# Altium schematic sheet Sheet1.SchDoc
size A0; Organization: Altium Limited; Address1: L3, 12a Rodborough Rd; Address2: Frenchs Forest; Address3: NSW; Address4: Australia 2086
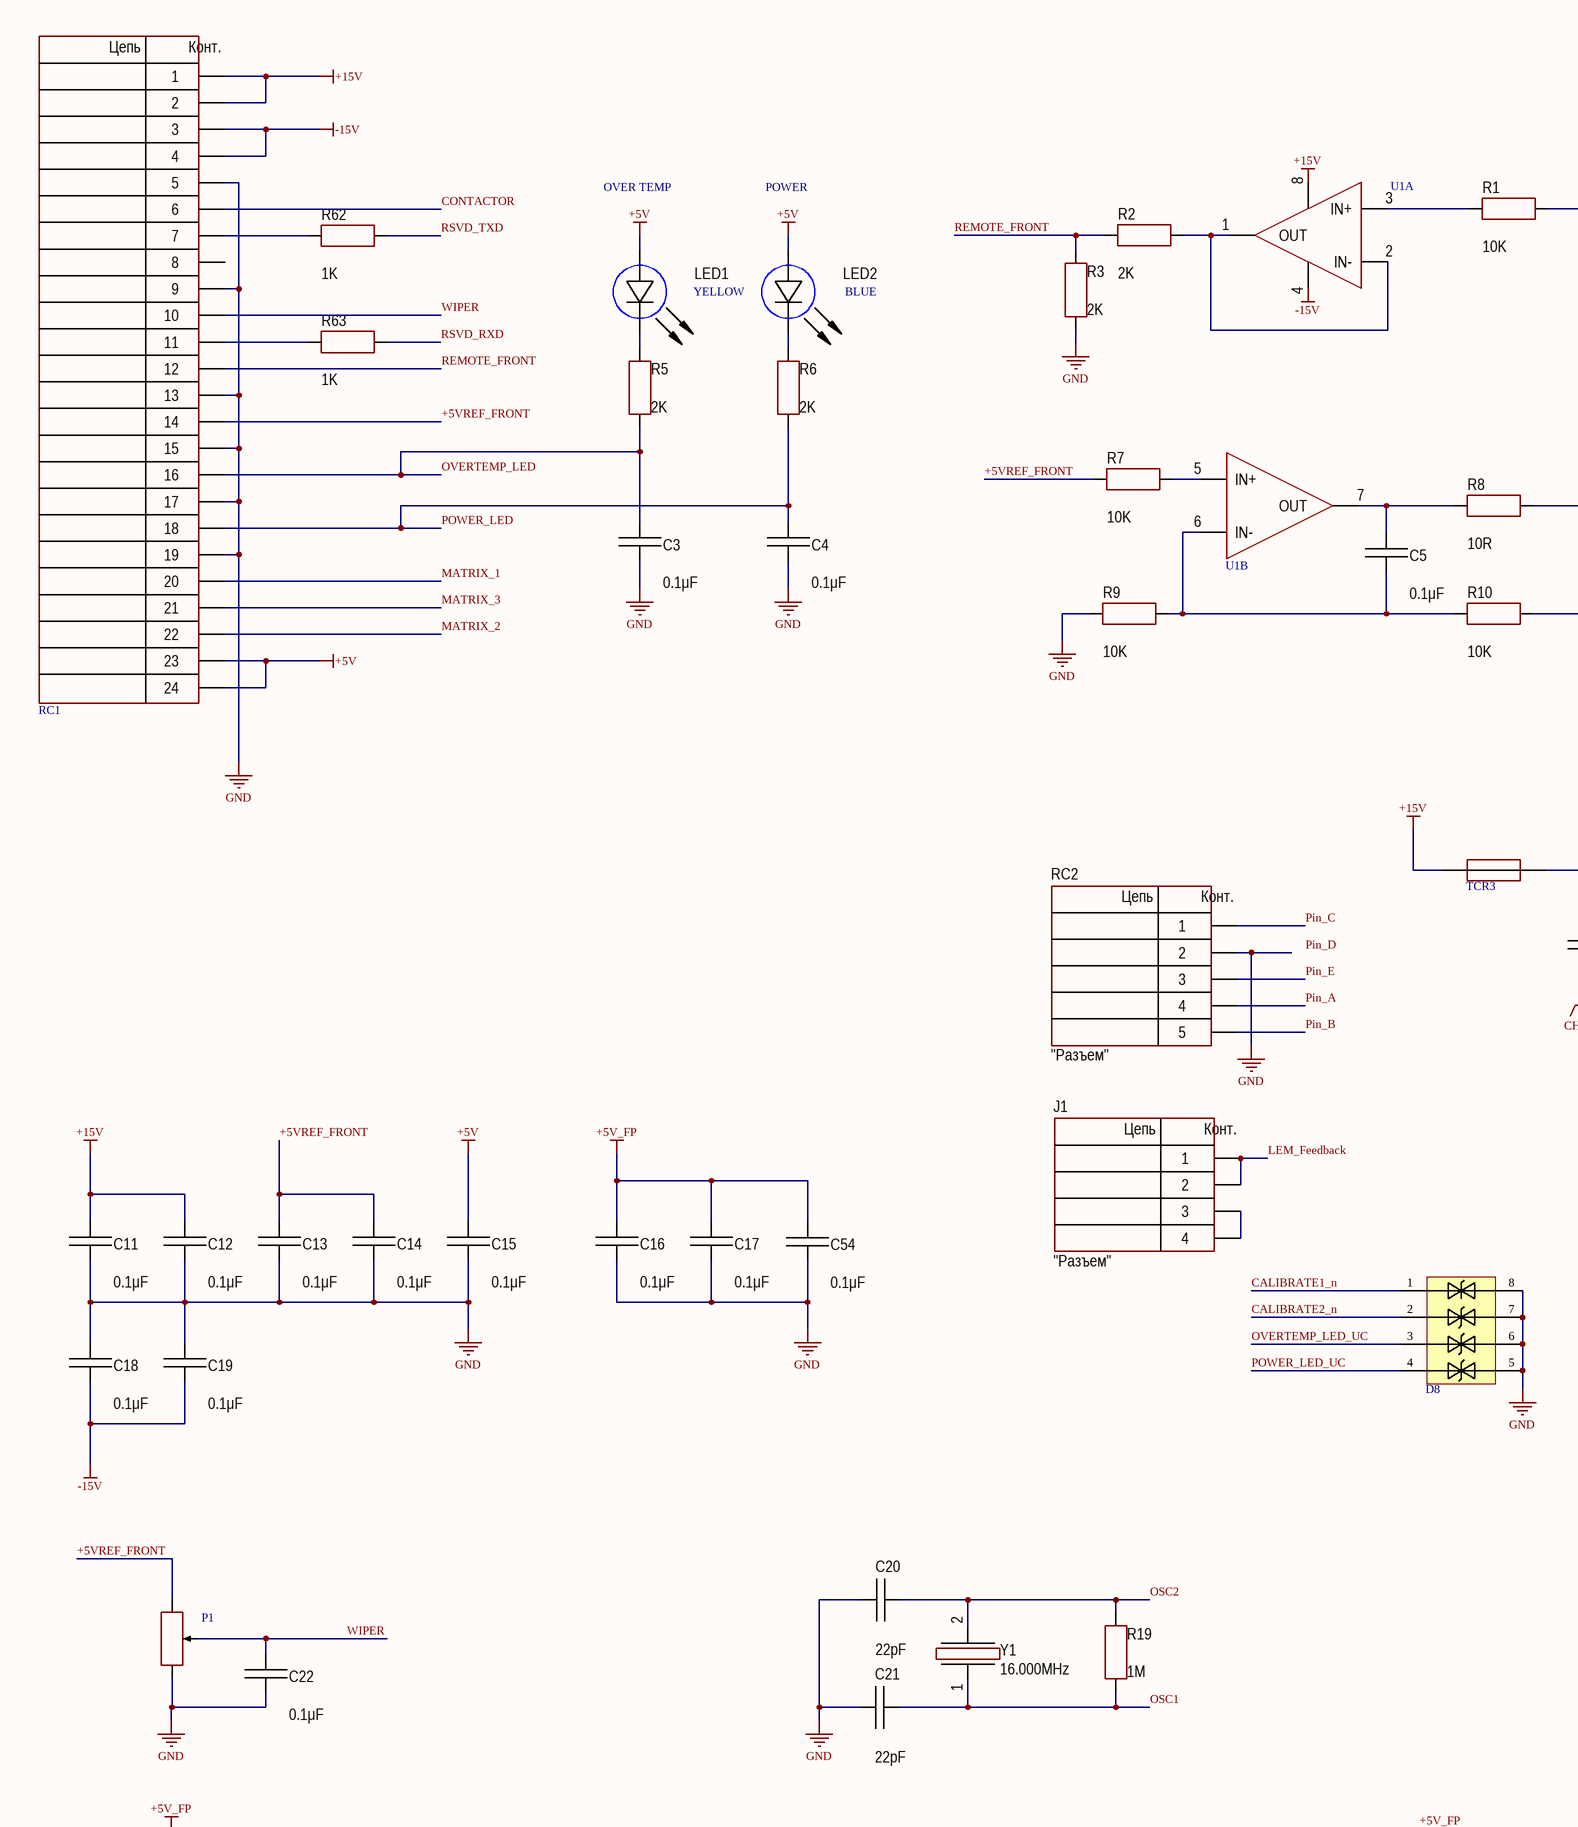
[diagram p0: Sheet1.SchDoc, top left]
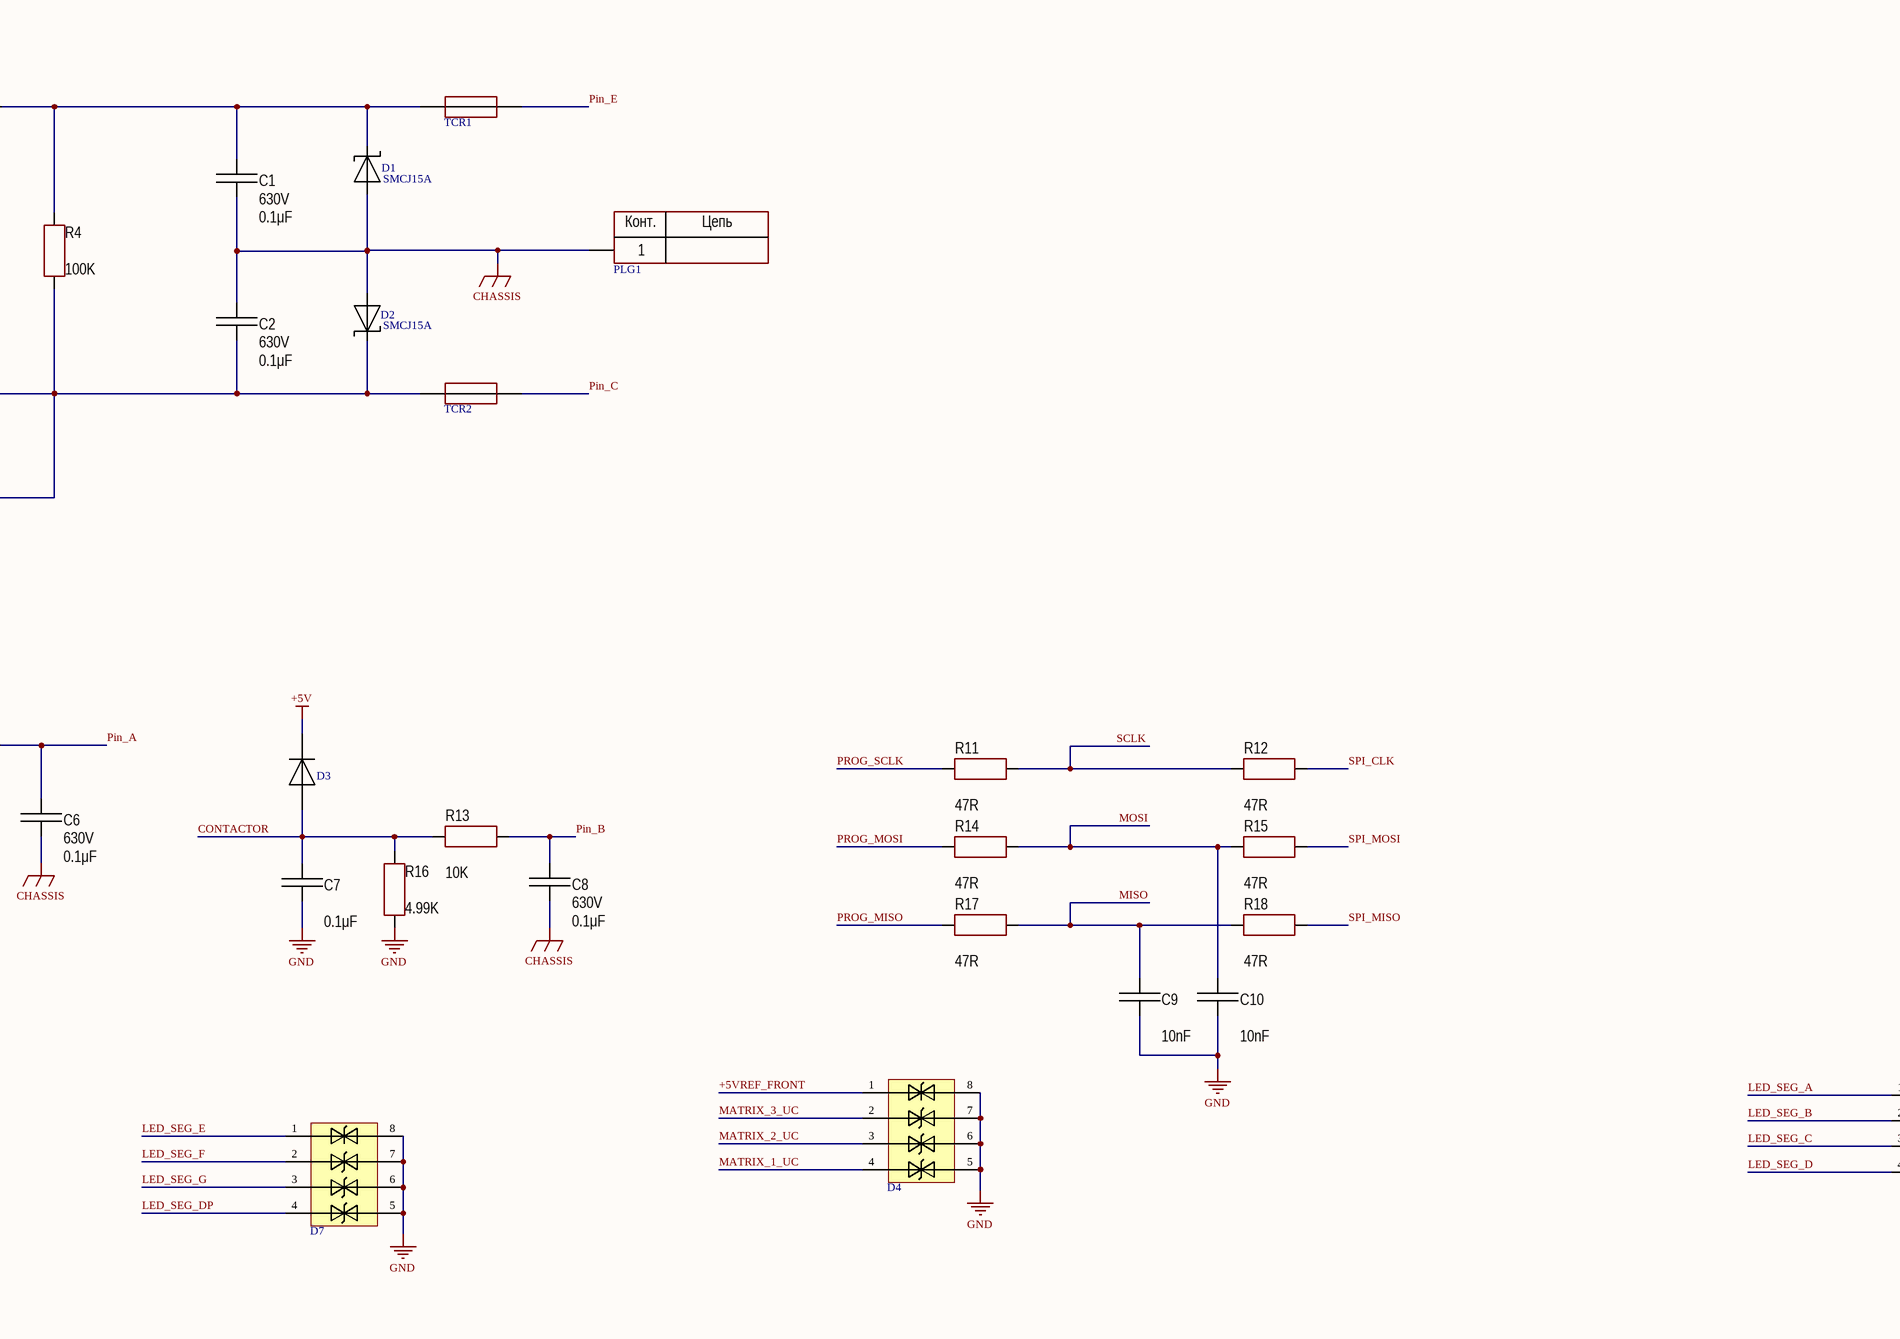
[diagram p1: Sheet1.SchDoc, top middle]
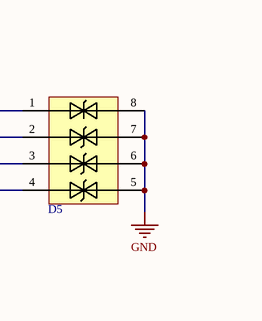
[diagram p2: Sheet1.SchDoc, top right]
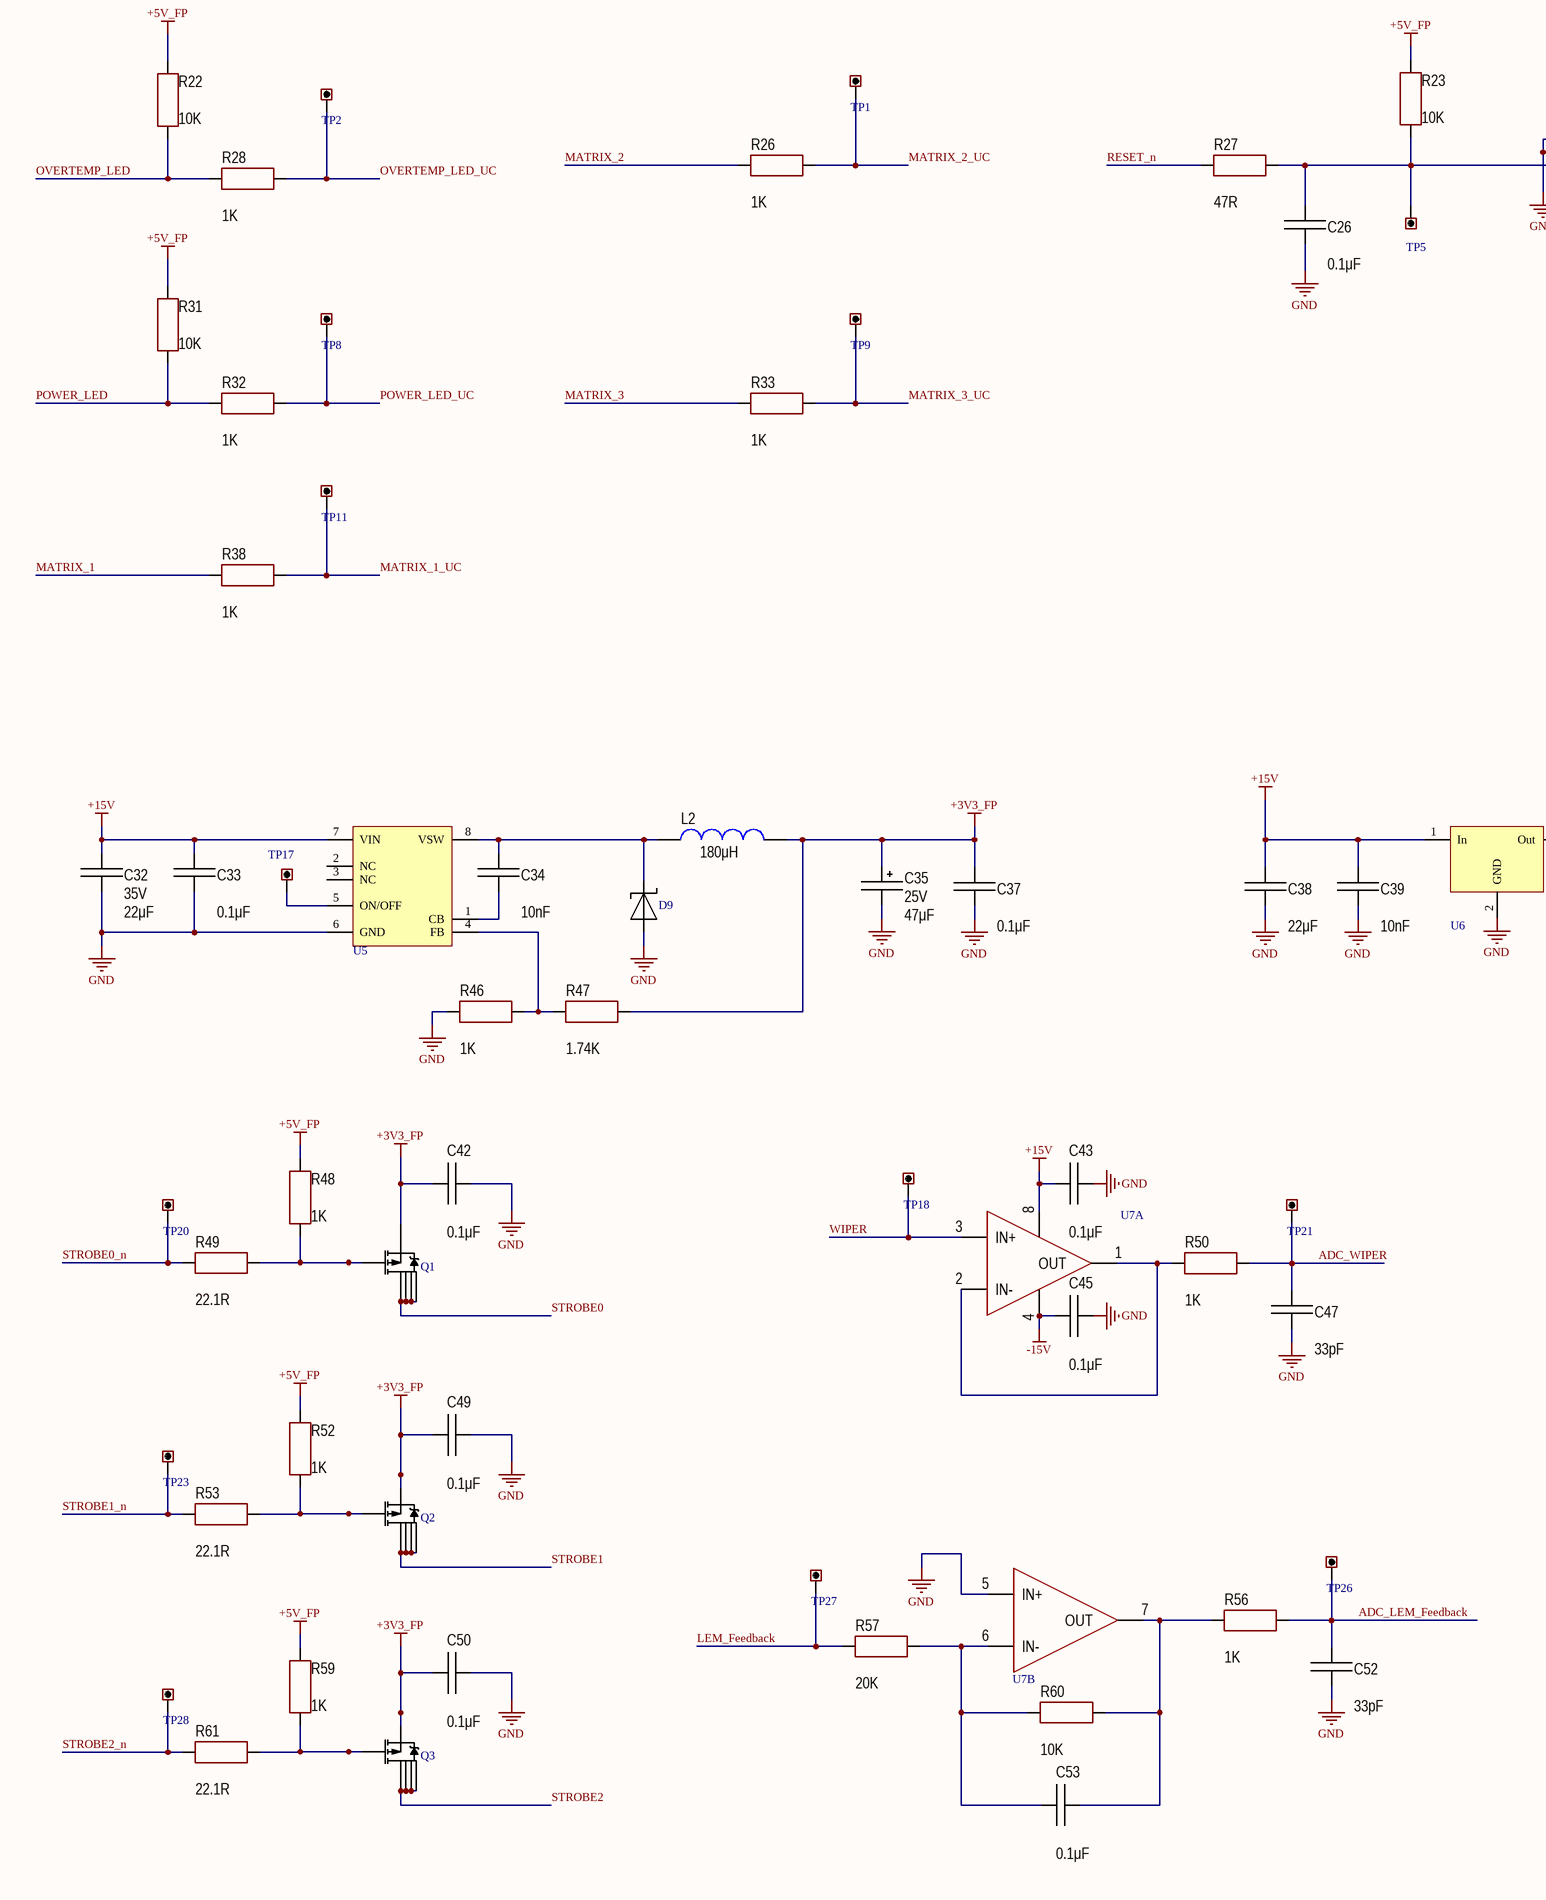
[diagram p3: Sheet1.SchDoc, bottom left]
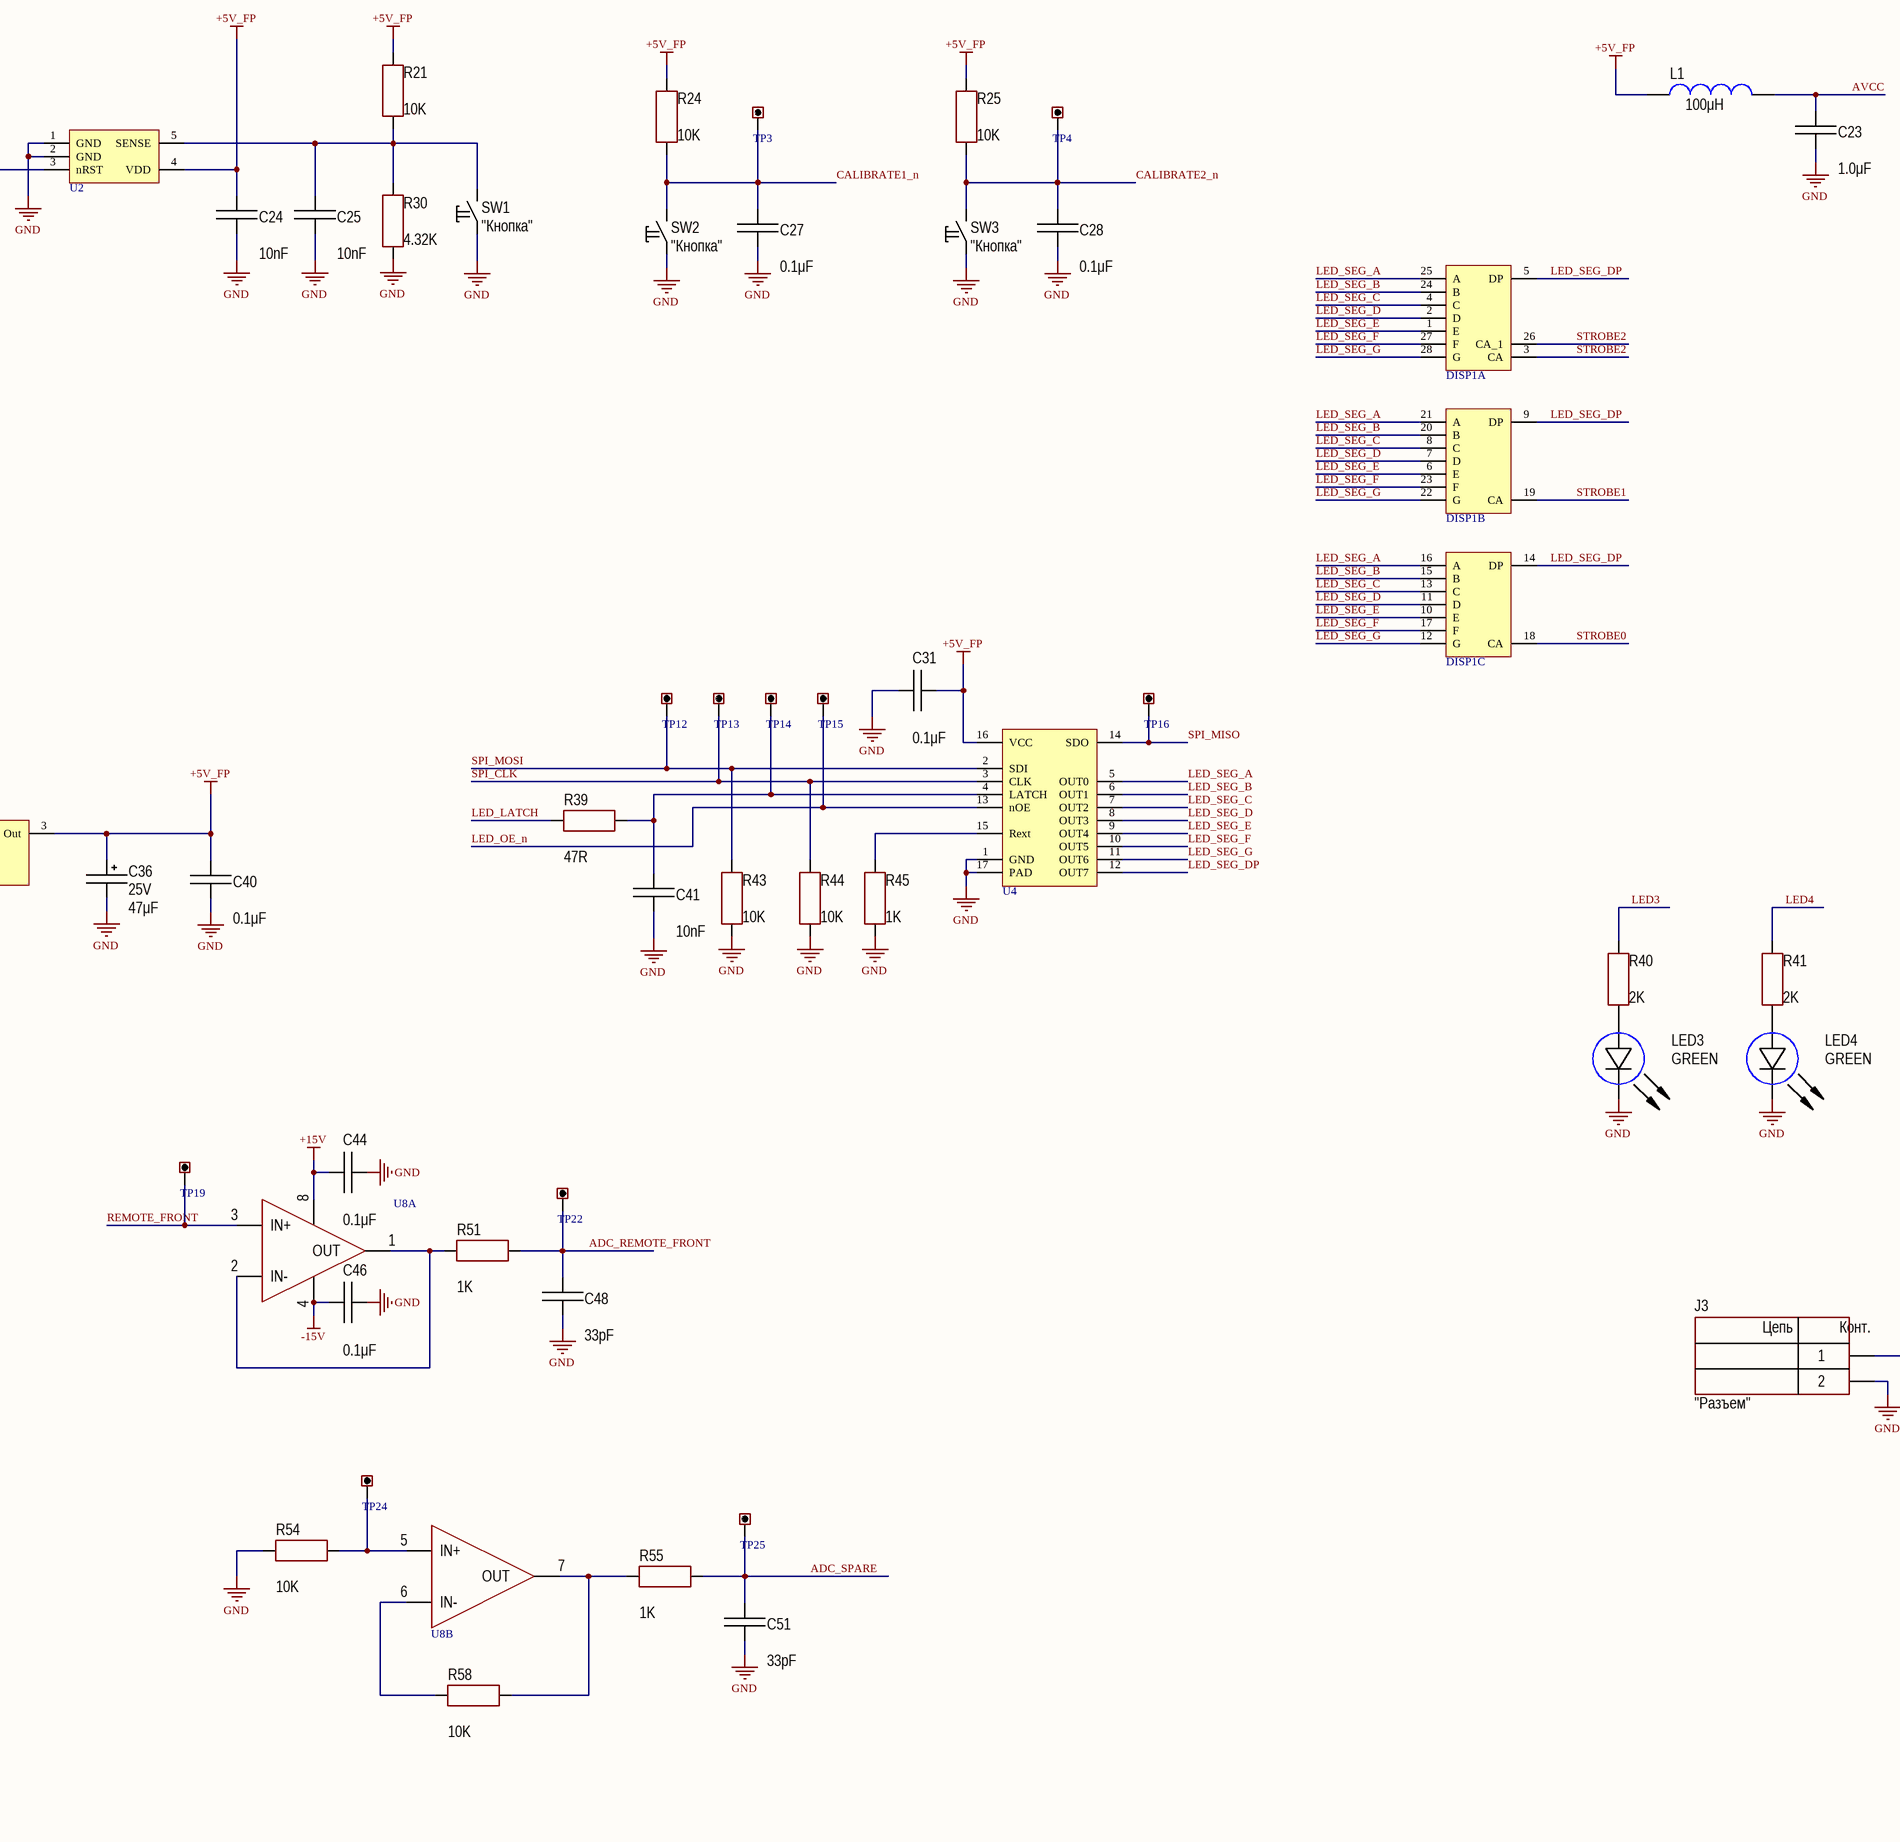
[diagram p4: Sheet1.SchDoc, bottom middle]
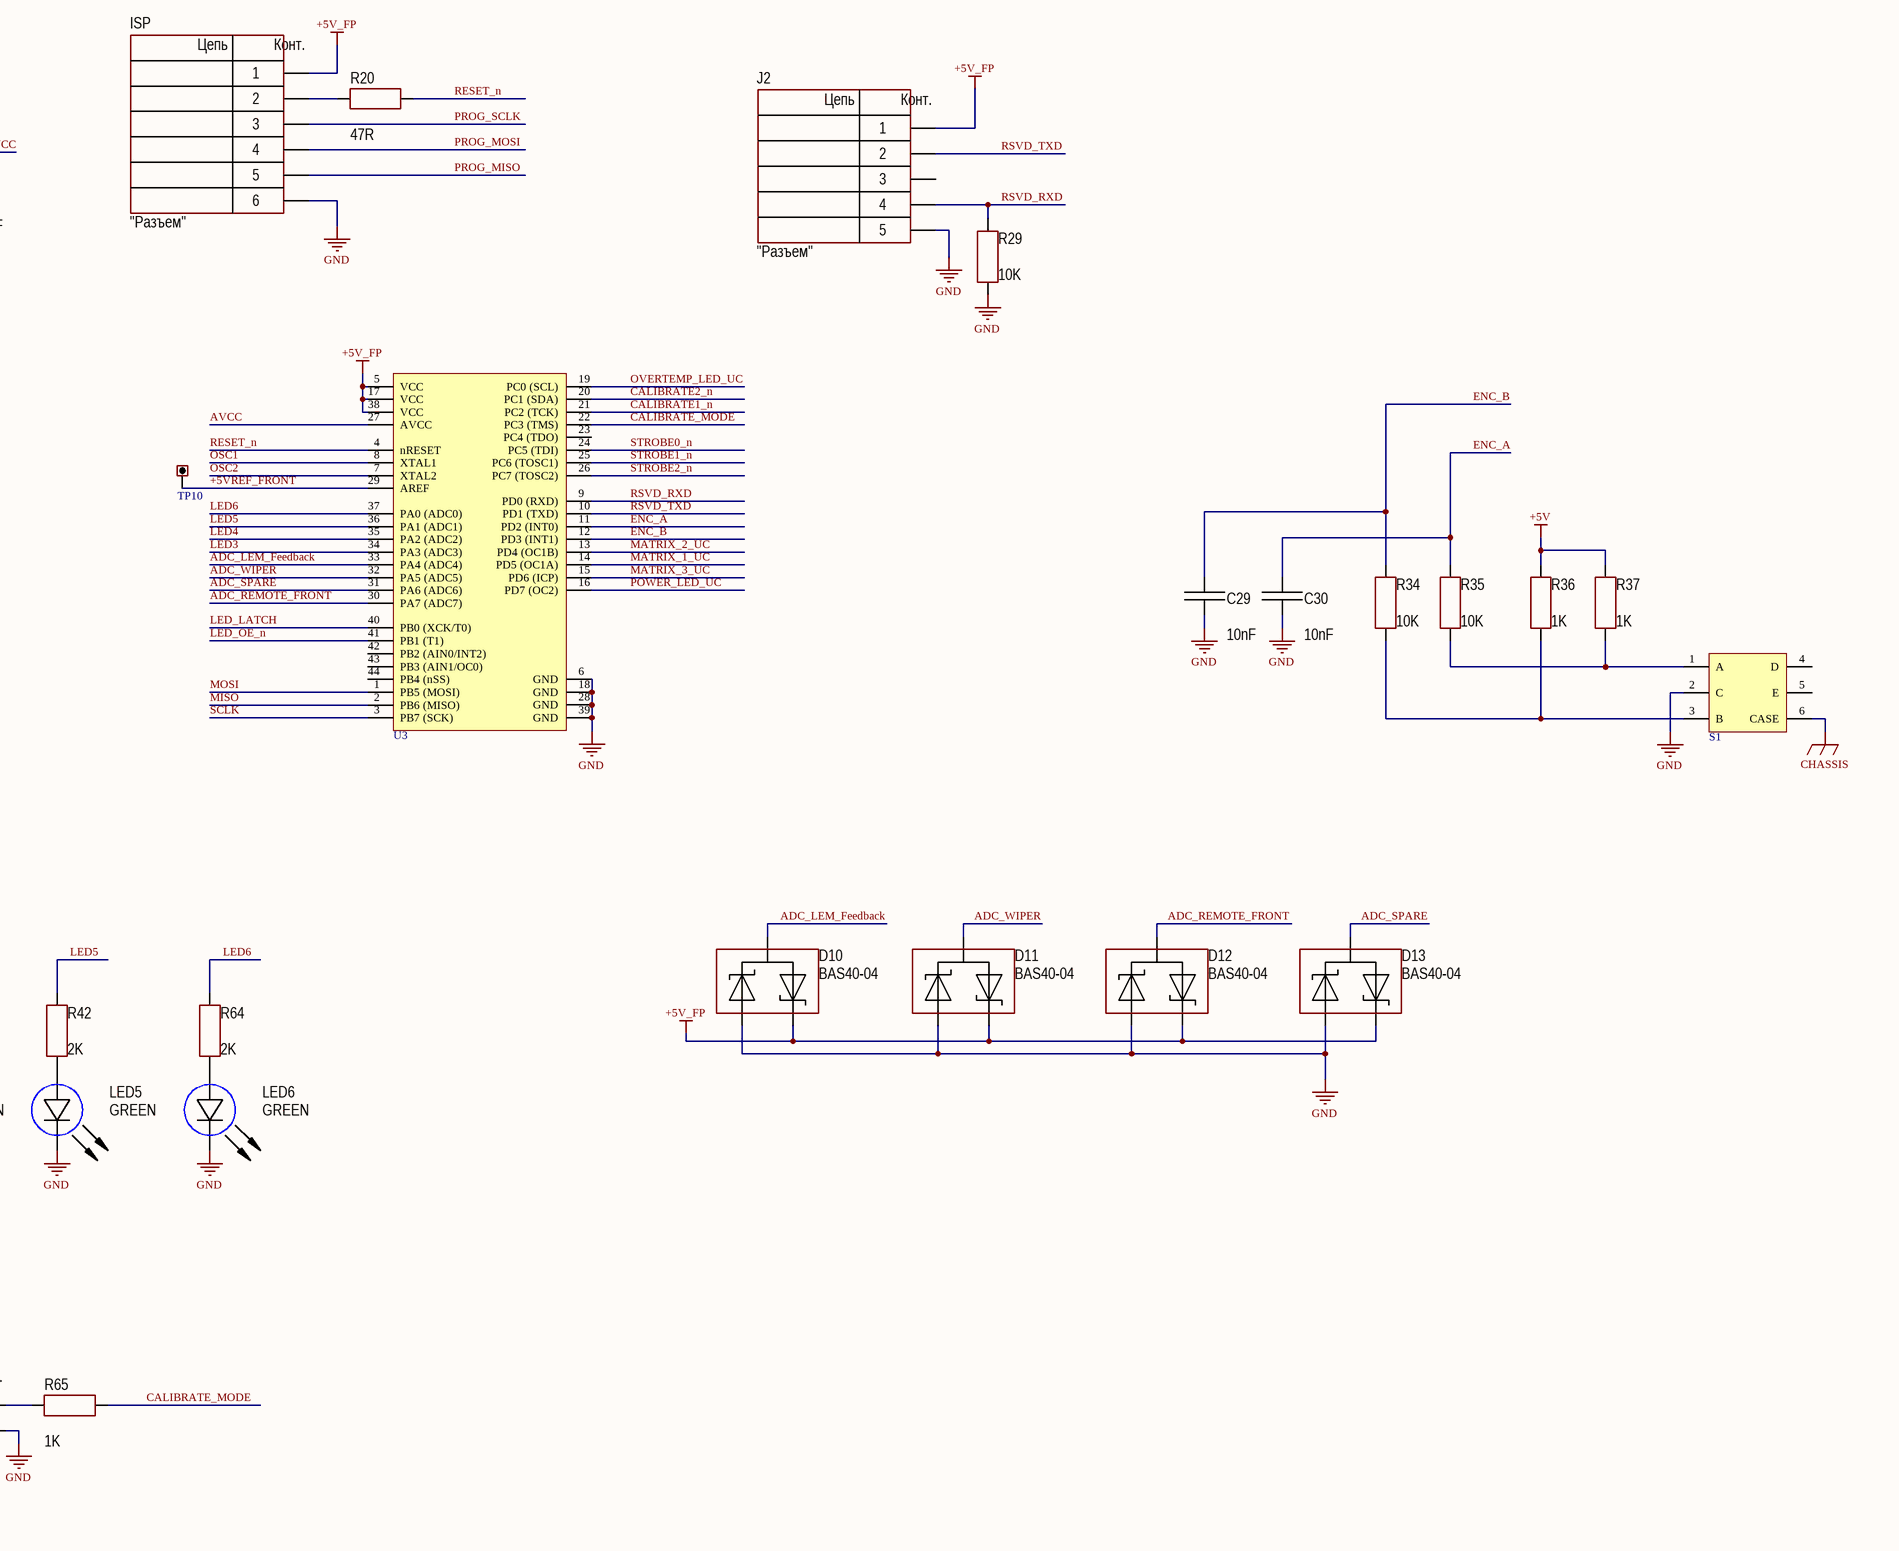
[diagram p5: Sheet1.SchDoc, bottom right]

## Parts
C1  value 0.1μF  Voltage: 630V  [CAPC4564X22M]
C2  value 0.1μF  Voltage: 630V  [CAPC4564X22M]
C3  value 0.1μF  [CAP: 1206]
C4  value 0.1μF  [CAP: 1206]
C5  value 0.1μF  [CAP: 1206]
C6  value 0.1μF  Voltage: 630V  [CAPC4564X22M]
C7  value 0.1μF  [CAP: 1206]
C8  value 0.1μF  Voltage: 630V  [CAPC4564X22M]
C9  value 10nF  [CAP: 1206]
C10  value 10nF  [CAP: 1206]
C11  value 0.1μF  [CAP: 1206]
C12  value 0.1μF  [CAP: 1206]
C13  value 0.1μF  [CAP: 1206]
C14  value 0.1μF  [CAP: 1206]
C15  value 0.1μF  [CAP: 1206]
C16  value 0.1μF  [CAP: 1206]
C17  value 0.1μF  [CAP: 1206]
C18  value 0.1μF  [CAP: 1206]
C19  value 0.1μF  [CAP: 1206]
C20  value 22pF  [CAP: 1206]
C21  value 22pF  [CAP: 1206]
C22  value 0.1μF  [CAP: 1206]
C23  value 1.0μF  [CAP: 1206]
C24  value 10nF  [CAP: 1206]
C25  value 10nF  [CAP: 1206]
C26  value 0.1μF  [CAP: 1206]
C27  value 0.1μF  [CAP: 1206]
C28  value 0.1μF  [CAP: 1206]
C29  value 10nF  [CAP: 1206]
C30  value 10nF  [CAP: 1206]
C31  value 0.1μF  [CAP: 1206]
C32  value 22μF  Voltage: 35V  [CAP: 1210]
C33  value 0.1μF  [CAP: 1206]
C34  value 10nF  [CAP: 1206]
C35  value 47μF  Voltage: 25V  [CAPAE7866X58L]
C36  value 47μF  Voltage: 25V  [CAPAE7866X58L]
C37  value 0.1μF  [CAP: 1206]
C38  value 22μF  [CAP: 1210]
C39  value 10nF  [CAP: 1206]
C40  value 0.1μF  [CAP: 1206]
C41  value 10nF  [CAP: 1206]
C42  value 0.1μF  [CAP: 1206]
C43  value 0.1μF  [CAP: 1206]
C44  value 0.1μF  [CAP: 1206]
C45  value 0.1μF  [CAP: 1206]
C46  value 0.1μF  [CAP: 1206]
C47  value 33pF  [CAP: 1206]
C48  value 33pF  [CAP: 1206]
C49  value 0.1μF  [CAP: 1206]
C50  value 0.1μF  [CAP: 1206]
C51  value 33pF  [CAP: 1206]
C52  value 33pF  [CAP: 1206]
C53  value 0.1μF  [CAP: 1206]
C54  value 0.1μF  [CAP: 1206]
D1  (no value)  [DIODE: SMC]
D2  (no value)  [DIODE: SMC]
D3  (no value)  [SOT23]
D4  (no value)  [8-SOIC]
D5  (no value)  [8-SOIC]
D7  (no value)  [8-SOIC]
D8  (no value)  [8-SOIC]
D9  (no value)  [DIODE: SMB]
D10  PartNumber: BAS40-04  [SOT23]
D11  PartNumber: BAS40-04  [SOT23]
D12  PartNumber: BAS40-04  [SOT23]
D13  PartNumber: BAS40-04  [SOT23]
DISP1  (no value)  [BA56-11SRWA]  (parts A,B,C of 3)
ISP  CommentText: "Разъем"  [CON: PLS-6]
J1  CommentText: "Разъем"  [39-29-9043]
J2  CommentText: "Разъем"  [CON: PLS-5]
J3  CommentText: "Разъем"  [CON: PLS-2]
L1  value 100μH  [RES: 1206]
L2  value 180μH  [7447720181@WURTH]
LED1  ColorParameter: YELLOW  [DIODE: LED5MM_Y]
LED2  ColorParameter: BLUE  [DIODE: LED5MM_G]
LED3  Color: GREEN  [DIODE: LED5MM_G]
LED4  Color: GREEN  [DIODE: LED5MM_G]
LED5  Color: GREEN  [DIODE: LED5MM_G]
LED6  Color: GREEN  [DIODE: LED5MM_G]
P1  (no value)  [СП4-2МА]
PLG1  PLG1  [PLG1]  (value not drawn)  (no BOM)
Q1  (no value)  [SOT23-6]
Q2  (no value)  [SOT23-6]
Q3  (no value)  [SOT23-6]
R1  value 10K  [RES: 1206]
R2  value 2K  [RES: 1206]
R3  value 2K  [RES: 1206]
R4  value 100K  [RES: 1206]
R5  value 2K  [RES: 1206]
R6  value 2K  [RES: 1206]
R7  value 10K  [RES: 1206]
R8  value 10R  [RES: 1206]
R9  value 10K  [RES: 1206]
R10  value 10K  [RES: 1206]
R11  value 47R  [RES: 1206]
R12  value 47R  [RES: 1206]
R13  value 10K  [RES: 1206]
R14  value 47R  [RES: 1206]
R15  value 47R  [RES: 1206]
R16  value 4.99K  [RES: 1206]
R17  value 47R  [RES: 1206]
R18  value 47R  [RES: 1206]
R19  value 1M  [RES: 1206]
R20  value 47R  [RES: 1206]
R21  value 10K  [RES: 1206]
R22  value 10K  [RES: 1206]
R23  value 10K  [RES: 1206]
R24  value 10K  [RES: 1206]
R25  value 10K  [RES: 1206]
R26  value 1K  [RES: 1206]
R27  value 47R  [RES: 1206]
R28  value 1K  [RES: 1206]
R29  value 10K  [RES: 1206]
R30  value 4.32K  [RES: 1206]
R31  value 10K  [RES: 1206]
R32  value 1K  [RES: 1206]
R33  value 1K  [RES: 1206]
R34  value 10K  [RES: 1206]
R35  value 10K  [RES: 1206]
R36  value 1K  [RES: 1206]
R37  value 1K  [RES: 1206]
R38  value 1K  [RES: 1206]
R39  value 47R  [RES: 1206]
R40  value 2K  [RES: 1206]
R41  value 2K  [RES: 1206]
R42  value 2K  [RES: 1206]
R43  value 10K  [RES: 1206]
R44  value 10K  [RES: 1206]
R45  value 1K  [RES: 1206]
R46  value 1K  [RES: 1206]
R47  value 1.74K  [RES: 1206]
R48  value 1K  [RES: 1206]
R49  value 22.1R  [RES: 1206]
R50  value 1K  [RES: 1206]
R51  value 1K  [RES: 1206]
R52  value 1K  [RES: 1206]
R53  value 22.1R  [RES: 1206]
R54  value 10K  [RES: 1206]
R55  value 1K  [RES: 1206]
R56  value 1K  [RES: 1206]
R57  value 20K  [RES: 1206]
R58  value 10K  [RES: 1206]
R59  value 1K  [RES: 1206]
R60  value 10K  [RES: 1206]
R61  value 22.1R  [RES: 1206]
R62  value 1K  [RES: 1206]
R63  value 1K  [RES: 1206]
R64  value 2K  [RES: 1206]
R65  value 1K  [RES: 1206]
RC1  (no value)  [DS1018-24 SIBX]
RC2  CommentText: "Разъем"  [MOLEX 39-30-3056]
S1  (no value)  [PEC11L]
SW1  CommentText: "Кнопка"  [DTSM-32]
SW2  CommentText: "Кнопка"  [DTSM-32]
SW3  CommentText: "Кнопка"  [DTSM-32]
TCR1  (no value)  [TRF250-120T-B-0.5]
TCR2  (no value)  [TRF250-120T-B-0.5]
TCR3  (no value)  [TRF250-120T-B-0.5]
TP1  Test_Point  [Test_Point]  (value not drawn)  (no BOM)
TP2  Test_Point  [Test_Point]  (value not drawn)  (no BOM)
TP3  Test_Point  [Test_Point]  (value not drawn)  (no BOM)
TP4  Test_Point  [Test_Point]  (value not drawn)  (no BOM)
TP5  Test_Point  [Test_Point]  (value not drawn)  (no BOM)
TP8  Test_Point  [Test_Point]  (value not drawn)  (no BOM)
TP9  Test_Point  [Test_Point]  (value not drawn)  (no BOM)
TP10  Test_Point  [Test_Point]  (value not drawn)  (no BOM)
TP11  Test_Point  [Test_Point]  (value not drawn)  (no BOM)
TP12  Test_Point  [Test_Point]  (value not drawn)  (no BOM)
TP13  Test_Point  [Test_Point]  (value not drawn)  (no BOM)
TP14  Test_Point  [Test_Point]  (value not drawn)  (no BOM)
TP15  Test_Point  [Test_Point]  (value not drawn)  (no BOM)
TP16  Test_Point  [Test_Point]  (value not drawn)  (no BOM)
TP17  Test_Point  [Test_Point]  (value not drawn)  (no BOM)
TP18  Test_Point  [Test_Point]  (value not drawn)  (no BOM)
TP19  Test_Point  [Test_Point]  (value not drawn)  (no BOM)
TP20  Test_Point  [Test_Point]  (value not drawn)  (no BOM)
TP21  Test_Point  [Test_Point]  (value not drawn)  (no BOM)
TP22  Test_Point  [Test_Point]  (value not drawn)  (no BOM)
TP23  Test_Point  [Test_Point]  (value not drawn)  (no BOM)
TP24  Test_Point  [Test_Point]  (value not drawn)  (no BOM)
TP25  Test_Point  [Test_Point]  (value not drawn)  (no BOM)
TP26  Test_Point  [Test_Point]  (value not drawn)  (no BOM)
TP27  Test_Point  [Test_Point]  (value not drawn)  (no BOM)
TP28  Test_Point  [Test_Point]  (value not drawn)  (no BOM)
U1  (no value)  [8-SOIC]  (parts A,B of 2)
U2  (no value)  [TPS3801]
U3  (no value)  [TQFP80P1200X1200X120-44L]
U4  (no value)  [STP08DP05]
U5  (no value)  [8-SOIC]
U6  (no value)  [DPAK]
U7  (no value)  [8-SOIC]  (parts A,B of 2)
U8  (no value)  [8-SOIC]  (parts A,B of 2)
Y1  Frequency: 16.000MHz  [HC49SM]

## Nets
+3V3_FP: C35.1 C37.2 C42.1 C49.1 C50.1 L2.1 Q1.4(S) Q2.4(S) Q3.4(S) R47.2
+5V: C15.2 D3.3 LED1.1(A) LED2.1(A) R36.2 R37.2 RC1.23 RC1.24
+5V_FP: C16.2 C17.2 C24.2 C31.2 C36.1 C40.2 C54.2 D10.2 D11.2 D12.2 D13.2 ISP.1 J2.1 L1.2 R21.1 R22.2 R23.1 R24.1 R25.1 R31.2 R48.2 R52.2 R59.2 U2.4(VDD) U3.5(VCC) U3.17(VCC) U3.38(VCC) U4.16(VCC) U6.3(Out)
+15V: C11.2 C12.2 C32.2 C33.2 C38.2 C39.2 C43.2 C44.2 RC1.1 RC1.2 TCR3.1 U1.8(V+) U5.7(VIN) U6.1(In) U7.8(V+) U8.8(V+)
-15V: C18.1 C19.1 C45.2 C46.2 RC1.3 RC1.4 U1.4(V-) U7.4(V-) U8.4(V-)
CHASSIS: C1.1 C2.2 C6.1 C8.1 D1.1(A) D2.1(A) PLG1.1 S1.6(CASE)
GND: C3.2 C4.2 C7.1 C9.1 C10.1 C11.1 C12.1 C13.1 C14.1 C15.1 C16.1 C17.1 C18.2 C19.2 C20.1 C21.1 C22.1 C23.1 C24.1 C25.1 C26.1 C27.1 C28.1 C29.1 C30.1 C31.1 C32.1 C33.1 C35.2 C36.2 C37.1 C38.1 C39.1 C40.1 C41.1 C42.2 C43.1 C44.1 C45.1 C46.1 C47.1 C48.1 C49.2 C50.2 C51.1 C52.1 C54.1 D4.5 D4.6 D4.7 D4.8 D5.5 D5.6 D5.7 D5.8 D7.5 D7.6 D7.7 D7.8 D8.5 D8.6 D8.7 D8.8 D9.1 D10.1 D11.1 D12.1 D13.1 ISP.6 J2.5 J3.2 LED3.2(C) LED4.2(C) LED5.2(C) LED6.2(C) P1.1(CCW) R3.1 R9.1 R16.1 R29.2 R30.2 R43.2 R44.2 R45.2 R46.1 R54.1 RC1.5 RC1.9 RC1.13 RC1.15 RC1.17 RC1.19 RC2.2 S1.2(C) SW1.1 SW2.1 SW3.1 U2.1(GND) U2.2(GND) U3.6(GND) U3.18(GND) U3.28(GND) U3.39(GND) U4.1(GND) U4.17(PAD) U5.6(GND) U6.2(GND) U7.5(IN+)
+5VREF_FRONT: C13.2 C14.2 D4.1 P1.3(CW) R7.1 RC1.14 TP10.1 U3.29(AREF)
ADC_LEM_Feedback: C52.2 D10.3 R56.2 TP26.1 U3.33(PA4_(ADC4))
ADC_REMOTE_FRONT: C48.2 D12.3 R51.2 TP22.1 U3.30(PA7_(ADC7))
ADC_SPARE: C51.2 D13.3 R55.2 TP25.1 U3.31(PA6_(ADC6))
ADC_WIPER: C47.2 D11.3 R50.2 TP21.1 U3.32(PA5_(ADC5))
AVCC: C23.2 L1.1 U3.27(AVCC)
CALIBRATE1_n: C27.2 D8.1 R24.2 SW2.2 TP3.1 U3.21(PC2_(TCK))
CALIBRATE2_n: C28.2 D8.2 R25.2 SW3.2 TP4.1 U3.20(PC1_(SDA))
CALIBRATE_MODE: R65.1 U3.22(PC3_(TMS))
CONTACTOR: C7.2 D3.1 R13.2 R16.2 RC1.6
ENC_A: C30.2 R35.2 U3.11(PD2_(INT0))
ENC_B: C29.2 R34.2 U3.12(PD3_(INT1))
LED3: R40.2 U3.34(PA3_(ADC3))
LED4: R41.2 U3.35(PA2_(ADC2))
LED5: R42.2 U3.36(PA1_(ADC1))
LED6: R64.2 U3.37(PA0_(ADC0))
LED_LATCH: R39.1 U3.40(PB0_(XCK/T0))
LED_OE_n: TP15.1 U3.41(PB1_(T1)) U4.13(nOE)
LED_SEG_A: D5.1 DISP1.16(A) DISP1.21(A) DISP1.25(A) U4.5(OUT0)
LED_SEG_B: D5.2 DISP1.15(B) DISP1.20(B) DISP1.24(B) U4.6(OUT1)
LED_SEG_C: D5.3 DISP1.4(C) DISP1.8(C) DISP1.13(C) U4.7(OUT2)
LED_SEG_D: D5.4 DISP1.2(D) DISP1.7(D) DISP1.11(D) U4.8(OUT3)
LED_SEG_DP: D7.4 DISP1.5(DP) DISP1.9(DP) DISP1.14(DP) U4.12(OUT7)
LED_SEG_E: D7.1 DISP1.1(E) DISP1.6(E) DISP1.10(E) U4.9(OUT4)
LED_SEG_F: D7.2 DISP1.17(F) DISP1.23(F) DISP1.27(F) U4.10(OUT5)
LED_SEG_G: D7.3 DISP1.12(G) DISP1.22(G) DISP1.28(G) U4.11(OUT6)
LEM_Feedback: J1.1 J1.2 R57.1 TP27.1
MATRIX_1: R38.2 RC1.20
MATRIX_1_UC: D4.4 R38.1 TP11.1 U3.14(PD5_(OC1A))
MATRIX_2: R26.2 RC1.22
MATRIX_2_UC: D4.3 R26.1 TP1.1 U3.13(PD4_(OC1B))
MATRIX_3: R33.2 RC1.21
MATRIX_3_UC: D4.2 R33.1 TP9.1 U3.15(PD6_(ICP))
MISO: C9.2 R17.1 R18.2 U3.2(PB6_(MISO))
MOSI: C10.2 R14.1 R15.2 U3.1(PB5_(MOSI))
OSC1: C21.2 R19.2 U3.8(XTAL1) Y1.1
OSC2: C20.2 R19.1 U3.7(XTAL2) Y1.2
OVERTEMP_LED: C3.1 R5.1 R22.1 R28.2 RC1.16
OVERTEMP_LED_UC: D8.3 R28.1 TP2.1 U3.19(PC0_(SCL))
Pin_A: C6.2 RC2.4 TCR3.2
Pin_B: C8.2 R13.1 RC2.5
Pin_C: RC2.1 TCR2.2
Pin_E: RC2.3 TCR1.2
POWER_LED: C4.1 R6.1 R31.1 R32.2 RC1.18
POWER_LED_UC: D8.4 R32.1 TP8.1 U3.16(PD7_(OC2))
PROG_MISO: ISP.5 R17.2
PROG_MOSI: ISP.4 R14.2
PROG_SCLK: ISP.3 R11.2
REMOTE_FRONT: R2.1 R3.2 RC1.12 TP19.1 U8.3(IN+)
RESET_n: R20.1 R27.2 U3.4(nRESET)
RSVD_RXD: J2.4 R29.1 R63.2 U3.9(PD0_(RXD))
RSVD_TXD: J2.2 R62.2 U3.10(PD1_(TXD))
SCLK: R11.1 R12.2 U3.3(PB7_(SCK))
SPI_CLK: R12.1 R44.1 TP13.1 U4.3(CLK)
SPI_MISO: R18.1 TP16.1 U4.14(SDO)
SPI_MOSI: R15.1 R43.1 TP12.1 U4.2(SDI)
STROBE0: DISP1.18(CA) Q1.1(D) Q1.2(D) Q1.5(D) Q1.6(D)
STROBE0_n: R49.1 TP20.1 U3.24(PC5_(TDI))
STROBE1: DISP1.19(CA) Q2.1(D) Q2.2(D) Q2.5(D) Q2.6(D)
STROBE1_n: R53.1 TP23.1 U3.25(PC6_(TOSC1))
STROBE2: DISP1.3(CA) DISP1.26(CA_1) Q3.1(D) Q3.2(D) Q3.5(D) Q3.6(D)
STROBE2_n: R61.1 TP28.1 U3.26(PC7_(TOSC2))
WIPER: C22.2 P1.2 RC1.10 TP18.1 U7.3(IN+)
NetC1_2: C1.2 D1.2(C) R1.2 R4.2 TCR1.1
NetC2_1: C2.1 D2.2(C) R4.1 R8.2 R10.2 TCR2.1
NetC5_1: C5.1 R9.2 R10.1 U1.6(IN-)
NetC5_2: C5.2 R8.1 U1.7(OUT)
NetC25_2: C25.2 R21.2 R30.1 SW1.2 U2.5(SENSE)
NetC26_2: C26.2 R23.2 R27.1 TP5.1 U2.3(nRST)
NetC34_1: C34.1 U5.1(CB)
NetC34_2: C34.2 D9.2 L2.2 U5.8(VSW)
NetC41_2: C41.2 R39.2 TP14.1 U4.4(LATCH)
NetC53_1: C53.1 R56.1 R60.2 U7.7(OUT)
NetC53_2: C53.2 R57.2 R60.1 U7.6(IN-)
NetISP_2: ISP.2 R20.2
NetJ1_3: J1.3 J1.4
NetJ3_1: J3.1 R65.2
NetLED1_2: LED1.2(C) R5.2
NetLED2_2: LED2.2(C) R6.2
NetLED3_1: LED3.1(A) R40.1
NetLED4_1: LED4.1(A) R41.1
NetLED5_1: LED5.1(A) R42.1
NetLED6_1: LED6.1(A) R64.1
NetQ1_3: Q1.3(G) R48.1 R49.2
NetQ2_3: Q2.3(G) R52.1 R53.2
NetQ3_3: Q3.3(G) R59.1 R61.2
NetR1_1: R1.1 U1.3(IN+)
NetR2_2: R2.2 U1.1(OUT) U1.2(IN-)
NetR7_2: R7.2 U1.5(IN+)
NetR34_1: R34.1 R36.1 S1.3(B)
NetR35_1: R35.1 R37.1 S1.1(A)
NetR45_1: R45.1 U4.15(Rext)
NetR46_2: R46.2 R47.1 U5.4(FB)
NetR50_1: R50.1 U7.1(OUT) U7.2(IN-)
NetR51_1: R51.1 U8.1(OUT) U8.2(IN-)
NetR54_2: R54.2 TP24.1 U8.5(IN+)
NetR55_1: R55.1 R58.2 U8.7(OUT)
NetR58_1: R58.1 U8.6(IN-)
NetR62_1: R62.1 RC1.7
NetR63_1: R63.1 RC1.11
NetTP17_1: TP17.1 U5.5(ON/OFF)

Not connected (* = marked no-connect by the designer): J2 3; RC1 8; S1 4(D) 5(E); U3 23(PC4_(TDO)) 42(PB2_(AIN0/INT2)) 43(PB3_(AIN1/OC0)) 44(PB4_(nSS)); U5 2(NC) 3(NC)

## Notes on the sheet
- OVER TEMP
- POWER
- Labels drawn without touching a wire or pin: Pin_D
- Title
- Size:
- Date:
- File:
- A0
- Number:
- Time:
- Revision:
- Sheet
- of
- (in symbol DS1018-24 SIBX) Цепь; Конт.
- (in symbol PBD-4) Цепь; Конт.
- (in symbol PBS-5) Цепь; Конт.
- (in symbol PLG1) Конт.; Цепь
- (in symbol PLS-2) Цепь; Конт.
- (in symbol PLS-6) Цепь; Конт.

## Library data of the parts
C1 C2 C6 C8 = Ceramic_1206: Manufacturer: Yageo; PartNumber: CC1206KRX7R9BB104; ValueManufacturerPartNumber: Ceramic capacitor, 0.1μF, 1825; TypeCapacitor: Ceramic capacitor; Tolerance: ±10%; TypeDielectric: X7R; Package: 1825; HelpURL: https://www.digikey.com/product-detail/en/yageo/CC1206KRX7R9BB104/311-1179-1-ND/303089; Temperature: -55...+125°C
C3-C5 C7 C11-C19 C22 C26-C28 C31 C33 C37 C40 C42-C46 C49 C50 C53 C54 = Ceramic_1206: Manufacturer: Yageo; PartNumber: CC1206KRX7R9BB104; ValueManufacturerPartNumber: Ceramic capacitor, 0.1μF, 1206; TypeCapacitor: Ceramic capacitor; Tolerance: ±10%; TypeDielectric: X7R; Voltage: 50V; Package: 1206; HelpURL: https://www.digikey.com/product-detail/en/yageo/CC1206KRX7R9BB104/311-1179-1-ND/303089; Temperature: -55...+125°C
C9 C10 C24 C25 C29 C30 C34 C39 C41 = Ceramic_1206: Manufacturer: Yageo; PartNumber: CC1206KRX7R9BB104; ValueManufacturerPartNumber: Ceramic capacitor, 10nF, 1206; TypeCapacitor: Ceramic capacitor; Tolerance: ±10%; TypeDielectric: X7R; Voltage: 50V; Package: 1206; HelpURL: https://www.digikey.com/product-detail/en/yageo/CC1206KRX7R9BB104/311-1179-1-ND/303089; Temperature: -55...+125°C
C20 C21 = Ceramic_1206: Manufacturer: Yageo; PartNumber: CC1206KRX7R9BB104; ValueManufacturerPartNumber: Ceramic capacitor, 22pF, 1206; TypeCapacitor: Ceramic capacitor; Tolerance: ±10%; TypeDielectric: X7R; Voltage: 50V; Package: 1206; HelpURL: https://www.digikey.com/product-detail/en/yageo/CC1206KRX7R9BB104/311-1179-1-ND/303089; Temperature: -55...+125°C
C23 = Ceramic_1206: Manufacturer: Yageo; PartNumber: CC1206KRX7R9BB104; ValueManufacturerPartNumber: Ceramic capacitor, 1.0μF, 1206; TypeCapacitor: Ceramic capacitor; Tolerance: ±10%; TypeDielectric: X7R; Voltage: 50V; Package: 1206; HelpURL: https://www.digikey.com/product-detail/en/yageo/CC1206KRX7R9BB104/311-1179-1-ND/303089; Temperature: -55...+125°C
C32 = Ceramic_1206: Manufacturer: Yageo; PartNumber: CC1206KRX7R9BB104; ValueManufacturerPartNumber: Ceramic capacitor, 22μF, 1206; TypeCapacitor: Ceramic capacitor; Tolerance: ±10%; TypeDielectric: X7R; Package: 1206; HelpURL: https://www.digikey.com/product-detail/en/yageo/CC1206KRX7R9BB104/311-1179-1-ND/303089; Temperature: -55...+125°C
C35 C36 = Aluminium: Manufacturer: Wurth; PartNumber: EEEFK1E470P; ValueManufacturerPartNumber: Aluminium capacitor, EEEFK1E470P, 47μF, 25V, D; TypeCapacitor: Aluminium capacitor; Tolerance: ±20%; Impedance: 54mOhm; Package: D; HelpURL: https://www.digikey.com/product-detail/en/wurth-electronics-inc/860080475013/732-9029-1-ND/5728972; Temperature: -55...+105°C
C38 = Ceramic_1206: Manufacturer: Yageo; PartNumber: CC1206KRX7R9BB104; ValueManufacturerPartNumber: Ceramic capacitor, 22μF, 1206; TypeCapacitor: Ceramic capacitor; Tolerance: ±10%; TypeDielectric: X7R; Voltage: 50V; Package: 1206; HelpURL: https://www.digikey.com/product-detail/en/yageo/CC1206KRX7R9BB104/311-1179-1-ND/303089; Temperature: -55...+125°C
C47 C48 C51 C52 = Ceramic_1206: Manufacturer: Yageo; PartNumber: CC1206KRX7R9BB104; ValueManufacturerPartNumber: Ceramic capacitor, 33pF, 1206; TypeCapacitor: Ceramic capacitor; Tolerance: ±10%; TypeDielectric: X7R; Voltage: 50V; Package: 1206; HelpURL: https://www.digikey.com/product-detail/en/yageo/CC1206KRX7R9BB104/311-1179-1-ND/303089; Temperature: -55...+125°C
D1 D2 = SMCJ15A: ValueManufacturerPartNumber: SMCJ15A, SMC; Package: SMC; PartNumber: SMCJ15A
D3 = MMBD4148: ValueManufacturerPartNumber: MMBD4148, SOT23; Package: SOT23; PartNumber: MMBD4148
D4 D5 D7 D8 = CDNBS08-T05C: ValueManufacturerPartNumber: CDNBS08-T05C, SOIC-8; Package: SOIC-8; PartNumber: CDNBS08-T05C
D9 = MBRS260T3G: ValueManufacturerPartNumber: MBRS260T3G, SMB; Package: SMB; PartNumber: MBRS260T3G
D10-D13 = Schottky_array: Manufacturer: Diodes Incorporated; ValueManufacturerPartNumber: BAS40-04, SOT23-3; TypeDiode: Schottky array; Voltage: 40V; Current: 120mA; VoltageDrop: 1V; RecoveryTime: 15pF; Package: SOT23-3; HelpURL: https://www.digikey.com/product-detail/en/diodes-incorporated/MBR0580S1-7/MBR0580S1-7DICT-ND/5080371; Temperature: -55...+150°C
DISP1 = BA56-11SRWA: ValueManufacturerPartNumber: LED display, BA56-11SRWA; PartNumber: BA56-11SRWA
ISP = PLS-6: Manufacturer: Connfly; ValueManufacturerPartNumber: Connector, PLS-6, 6 pin; TypeConnector: Connector; VoltageMax: 500VAC; Pitch: 2.54mm; CurrentMax: 3A; Multichannel: 6 pin; HelpURL: https://www.chipdip.ru/product/pls-6; PartNumber: PLS-6
J1 = PBD-4: Manufacturer: MOLEX; ValueManufacturerPartNumber: Connector, MOLEX, 39-29-9043, 4pin; TypeConnector: Connector; VoltageMax: 500VAC; Pitch: 2.54mm; CurrentMax: 3A; Multichannel: 4pin; HelpURL: https://www.chipdip.ru/product/pbd-4; PartNumber: 39-29-9043
J2 = PBS-5: Manufacturer: Connfly; ValueManufacturerPartNumber: Connector, PBS-5, 5 pin; TypeConnector: Connector; VoltageMax: 500VAC; Pitch: 2.54mm; CurrentMax: 3A; Multichannel: 5 pin; HelpURL: https://www.chipdip.ru/product/pbs-5; PartNumber: PBS-5
J3 = PLS-2: Manufacturer: Connfly; ValueManufacturerPartNumber: PLS-2, 2pin; TypeConnector: Connector; VoltageMax: 500VAC; Pitch: 2.54mm; CurrentMax: 3A; Multichannel: 2pin; HelpURL: https://www.chipdip.ru/product/pls-2; PartNumber: PLS-2
L1 = Inductor_0805: Manufacturer: Murata Electronics; PartNumber: LQM21FN100M70L; ValueManufacturerPartNumber: Fixed inductor, 100μH, 1206; TypeInductor: Fixed inductor; MaxCurrent: 100mA; Tolerance: ±20%; Package: 1206; HelpURL: https://www.digikey.com/product-detail/en/murata-electronics-north-america/LQM21FN100M70L/490-4029-1-ND/1016289; Temperature: -55...+125°C
L2 = Inductor_0805: Manufacturer: WURTH; PartNumber: 7447720181; ValueManufacturerPartNumber: Fixed inductor, WURTH, 7447720181, 180μH; TypeInductor: Fixed inductor; MaxCurrent: 1A; Tolerance: ±20%; Package: 0805; HelpURL: https://www.digikey.com/product-detail/en/murata-electronics-north-america/LQM21FN100M70L/490-4029-1-ND/1016289; Temperature: -55...+125°C
LED1 = LED_single: ValueManufacturerPartNumber: LED, YELLOW, 5 mm; TypeDiode: LED; Manufacturer: *; Package: 5 mm; HelpURL: *; Temperature: -55...+150°C; Current: *; VoltageDrop: *; PartNumber: *; Color: YELLOW
LED2 = LED_single: ValueManufacturerPartNumber: LED, BLUE, 5 mm; TypeDiode: LED; Manufacturer: *; Package: 5 mm; HelpURL: *; Temperature: -55...+150°C; Current: *; VoltageDrop: *; PartNumber: *; Color: BLUE
LED3-LED6 = LED_single: ValueManufacturerPartNumber: LED, GREEN, 5 mm; TypeDiode: LED; Manufacturer: *; Package: 5 mm; HelpURL: *; Temperature: -55...+150°C; Current: *; VoltageDrop: *; PartNumber: *; ColorParameter: GREEN
P1 = СП4-2МА: ValueManufacturerPartNumber: СП4-2МА; PartNumber: СП4-2МА
Q1-Q3 = DMP2067LVT: ValueManufacturerPartNumber: DMP2067LVT, SOT23-6; Package: SOT23-6; PartNumber: DMP2067LVT
R1 R7 R9 R10 R13 R21-R25 R29 R31 R34 R35 R43 R44 R54 R58 R60 = Resistor_1206: Manufacturer: Yageo; PartNumber: RC1206JR-07100RL; ValueManufacturerPartNumber: Resistor, 10K, 1206; Power: 0.25W; Tolerance: ±5%; Package: 1206; HelpURL: https://www.digikey.com/product-detail/en/yageo/RC1206JR-07100RL/311-100ERCT-ND/732153; Temperature: -55...+125°C; TypeResistor: Resistor
R2 R3 R5 R6 R40-R42 R64 = Resistor_1206: Manufacturer: Yageo; PartNumber: RC1206JR-07100RL; ValueManufacturerPartNumber: Resistor, 2K, 1206; Power: 0.25W; Tolerance: ±5%; Package: 1206; HelpURL: https://www.digikey.com/product-detail/en/yageo/RC1206JR-07100RL/311-100ERCT-ND/732153; Temperature: -55...+125°C; TypeResistor: Resistor
R4 = Resistor_1206: Manufacturer: Yageo; PartNumber: RC1206JR-07100RL; ValueManufacturerPartNumber: Resistor, 100K, 1206; Power: 0.25W; Tolerance: ±5%; Package: 1206; HelpURL: https://www.digikey.com/product-detail/en/yageo/RC1206JR-07100RL/311-100ERCT-ND/732153; Temperature: -55...+125°C; TypeResistor: Resistor
R8 = Resistor_1206: Manufacturer: Yageo; PartNumber: RC1206JR-07100RL; ValueManufacturerPartNumber: Resistor, 10R, 1206; Power: 0.25W; Tolerance: ±5%; Package: 1206; HelpURL: https://www.digikey.com/product-detail/en/yageo/RC1206JR-07100RL/311-100ERCT-ND/732153; Temperature: -55...+125°C; TypeResistor: Resistor
R11 R12 R14 R15 R17 R18 R20 R27 R39 = Resistor_1206: Manufacturer: Yageo; PartNumber: RC1206JR-07100RL; ValueManufacturerPartNumber: Resistor, 47R, 1206; Power: 0.25W; Tolerance: ±5%; Package: 1206; HelpURL: https://www.digikey.com/product-detail/en/yageo/RC1206JR-07100RL/311-100ERCT-ND/732153; Temperature: -55...+125°C; TypeResistor: Resistor
R16 = Resistor_1206: Manufacturer: Yageo; PartNumber: RC1206JR-07100RL; ValueManufacturerPartNumber: Resistor, 4.99K, 1206; Power: 0.25W; Tolerance: ±5%; Package: 1206; HelpURL: https://www.digikey.com/product-detail/en/yageo/RC1206JR-07100RL/311-100ERCT-ND/732153; Temperature: -55...+125°C; TypeResistor: Resistor
R19 = Resistor_1206: Manufacturer: Yageo; PartNumber: RC1206JR-07100RL; ValueManufacturerPartNumber: Resistor, 1M, 1206; Power: 0.25W; Tolerance: ±5%; Package: 1206; HelpURL: https://www.digikey.com/product-detail/en/yageo/RC1206JR-07100RL/311-100ERCT-ND/732153; Temperature: -55...+125°C; TypeResistor: Resistor
R26 R28 R32 R33 R36-R38 R45 R46 R48 R50-R52 R55 R56 R59 R62 R63 R65 = Resistor_1206: Manufacturer: Yageo; PartNumber: RC1206JR-07100RL; ValueManufacturerPartNumber: Resistor, 1K, 1206; Power: 0.25W; Tolerance: ±5%; Package: 1206; HelpURL: https://www.digikey.com/product-detail/en/yageo/RC1206JR-07100RL/311-100ERCT-ND/732153; Temperature: -55...+125°C; TypeResistor: Resistor
R30 = Resistor_1206: Manufacturer: Yageo; PartNumber: RC1206JR-07100RL; ValueManufacturerPartNumber: Resistor, 4.32K, 1206; Power: 0.25W; Tolerance: ±5%; Package: 1206; HelpURL: https://www.digikey.com/product-detail/en/yageo/RC1206JR-07100RL/311-100ERCT-ND/732153; Temperature: -55...+125°C; TypeResistor: Resistor
R47 = Resistor_1206: Manufacturer: Yageo; PartNumber: RC1206JR-07100RL; ValueManufacturerPartNumber: Resistor, 1.74K, 1206; Power: 0.25W; Tolerance: ±5%; Package: 1206; HelpURL: https://www.digikey.com/product-detail/en/yageo/RC1206JR-07100RL/311-100ERCT-ND/732153; Temperature: -55...+125°C; TypeResistor: Resistor
R49 R53 R61 = Resistor_1206: Manufacturer: Yageo; PartNumber: RC1206JR-07100RL; ValueManufacturerPartNumber: Resistor, 22.1R, 1206; Power: 0.25W; Tolerance: ±5%; Package: 1206; HelpURL: https://www.digikey.com/product-detail/en/yageo/RC1206JR-07100RL/311-100ERCT-ND/732153; Temperature: -55...+125°C; TypeResistor: Resistor
R57 = Resistor_1206: Manufacturer: Yageo; PartNumber: RC1206JR-07100RL; ValueManufacturerPartNumber: Resistor, 20K, 1206; Power: 0.25W; Tolerance: ±5%; Package: 1206; HelpURL: https://www.digikey.com/product-detail/en/yageo/RC1206JR-07100RL/311-100ERCT-ND/732153; Temperature: -55...+125°C; TypeResistor: Resistor
RC1 = DS1018-24 SIBX: ValueManufacturerPartNumber: Connector, DS1018-24 SIBX, 24 pin; Multichannel: 24 pin; TypeConnector: Connector; PartNumber: DS1018-24 SIBX
RC2 = PBS-5: Manufacturer: MOLEX; ValueManufacturerPartNumber: Connector, MOLEX, 39-30-3056, 5pin; TypeConnector: Connector; VoltageMax: 500VAC; Pitch: 2.54mm; CurrentMax: 3A; Multichannel: 5pin; HelpURL: https://www.chipdip.ru/product/pbs-5; PartNumber: 39-30-3056
S1 = PEC11L: ValueManufacturerPartNumber: PEC11L; PartNumber: PEC11L
SW1-SW3 = Button_tactile: Manufacturer: TE Connectivity; ValueManufacturerPartNumber: Tactile button, DTSM-32; TypeButton: Tactile button; HelpURL: https://www.digikey.com/product-detail/en/te-connectivity-alcoswitch-switches/FSM2JSMAATR/450-1792-1-ND/3503931; PartNumber: DTSM-32; Package: 6x6mm
TCR1-TCR3 = TRF250-120T-B-0.5: ValueManufacturerPartNumber: TRF250-120T-B-0.5; PartNumber: TRF250-120T-B-0.5
U1 U7 U8 = TL082: ValueManufacturerPartNumber: TL082, SOIC-8; Package: SOIC-8; PartNumber: TL082
U2 = TPS3801: ValueManufacturerPartNumber: TPS3801, SOT23-5; Package: SOT23-5; PartNumber: TPS3801
U3 = ATMega16-16AU: ValueManufacturerPartNumber: ATMega16-16AU, TQFP-44; Package: TQFP-44; PartNumber: ATMega16-16AU
U4 = STP08DP05: ValueManufacturerPartNumber: STP08DP05, TSOP-16; Package: TSOP-16; PartNumber: STP08DP05
U5 = LM2675: ValueManufacturerPartNumber: LM2675, SOIC-8; Package: SOIC-8; PartNumber: LM2675
U6 = LM78M05CDT: ValueManufacturerPartNumber: LM78M05CDT, DPAK; Package: DPAK; PartNumber: LM78M05CDT
Y1 = Crystal_3215: Manufacturer: Epson; PartNumber: HC49SM-16.000MHZ-20PF; ValueManufacturerPartNumber: HC49SM-16.000MHZ-20PF, HC49SM; LoadCapacitance: 12.5pF; Tolerance: ±20ppm; Package: HC49SM; HelpURL: https://www.digikey.com/product-detail/en/epson/FC-135-32.7680KA-A5/SER4103CT-ND/6188447; Temperature: -40...+85°C; TypeOscilator: Crystal